# Altium schematic sheet Sheet1.SchDoc
size A4
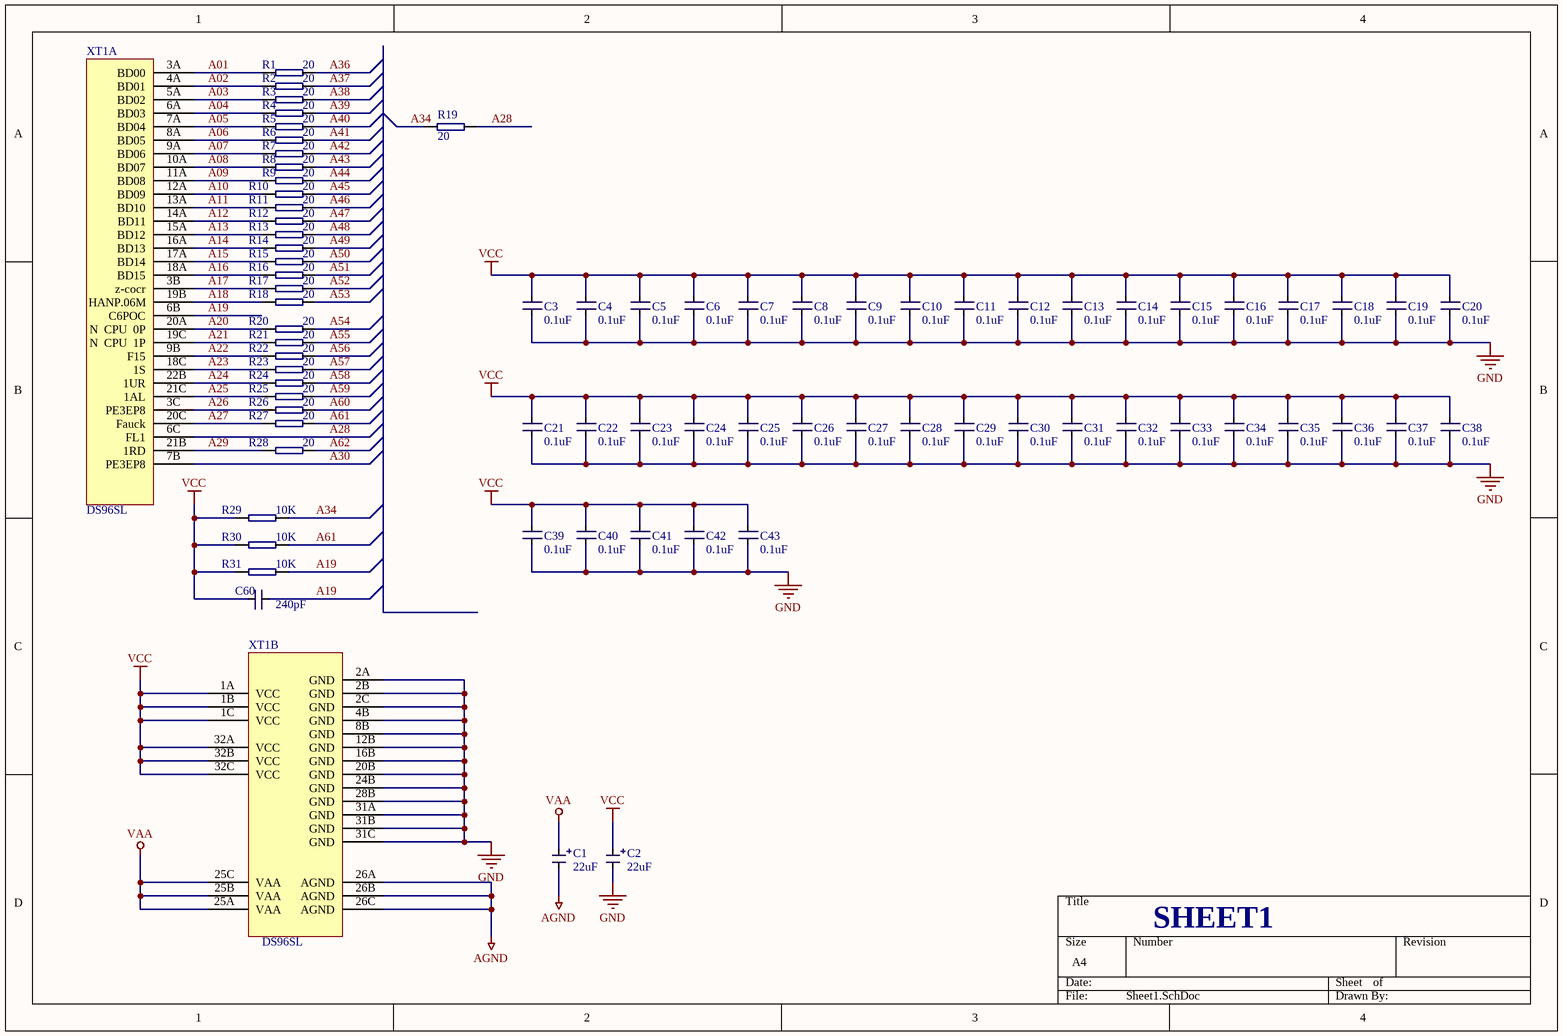
[diagram p0: Sheet1.SchDoc]

## Parts
C1  value 22uF  [B(1812)]  (hidden comment: Cap2)
C2  value 22uF  [B(1812)]  (hidden comment: Cap2)
C3  value 0.1uF  [0805]  (hidden comment: Cap)
C4  value 0.1uF  [0805]  (hidden comment: Cap)
C5  value 0.1uF  [0805]  (hidden comment: Cap)
C6  value 0.1uF  [0805]  (hidden comment: Cap)
C7  value 0.1uF  [0805]  (hidden comment: Cap)
C8  value 0.1uF  [0805]  (hidden comment: Cap)
C9  value 0.1uF  [0805]  (hidden comment: Cap)
C10  value 0.1uF  [0805]  (hidden comment: Cap)
C11  value 0.1uF  [0805]  (hidden comment: Cap)
C12  value 0.1uF  [0805]  (hidden comment: Cap)
C13  value 0.1uF  [0805]  (hidden comment: Cap)
C14  value 0.1uF  [0805]  (hidden comment: Cap)
C15  value 0.1uF  [0805]  (hidden comment: Cap)
C16  value 0.1uF  [0805]  (hidden comment: Cap)
C17  value 0.1uF  [0805]  (hidden comment: Cap)
C18  value 0.1uF  [0805]  (hidden comment: Cap)
C19  value 0.1uF  [0805]  (hidden comment: Cap)
C20  value 0.1uF  [0805]  (hidden comment: Cap)
C21  value 0.1uF  [0805]  (hidden comment: Cap)
C22  value 0.1uF  [0805]  (hidden comment: Cap)
C23  value 0.1uF  [0805]  (hidden comment: Cap)
C24  value 0.1uF  [0805]  (hidden comment: Cap)
C25  value 0.1uF  [0805]  (hidden comment: Cap)
C26  value 0.1uF  [0805]  (hidden comment: Cap)
C27  value 0.1uF  [0805]  (hidden comment: Cap)
C28  value 0.1uF  [0805]  (hidden comment: Cap)
C29  value 0.1uF  [0805]  (hidden comment: Cap)
C30  value 0.1uF  [0805]  (hidden comment: Cap)
C31  value 0.1uF  [0805]  (hidden comment: Cap)
C32  value 0.1uF  [0805]  (hidden comment: Cap)
C33  value 0.1uF  [0805]  (hidden comment: Cap)
C34  value 0.1uF  [0805]  (hidden comment: Cap)
C35  value 0.1uF  [0805]  (hidden comment: Cap)
C36  value 0.1uF  [0805]  (hidden comment: Cap)
C37  value 0.1uF  [0805]  (hidden comment: Cap)
C38  value 0.1uF  [0805]  (hidden comment: Cap)
C39  value 0.1uF  [0805]  (hidden comment: Cap)
C40  value 0.1uF  [0805]  (hidden comment: Cap)
C41  value 0.1uF  [0805]  (hidden comment: Cap)
C42  value 0.1uF  [0805]  (hidden comment: Cap)
C43  value 0.1uF  [0805]  (hidden comment: Cap)
C60  value 240pF  [0805]  (hidden comment: Cap)
R1  value 20  [0805]  (hidden comment: R)
R2  value 20  [0805]  (hidden comment: R)
R3  value 20  [0805]  (hidden comment: R)
R4  value 20  [0805]  (hidden comment: R)
R5  value 20  [0805]  (hidden comment: R)
R6  value 20  [0805]  (hidden comment: R)
R7  value 20  [0805]  (hidden comment: R)
R8  value 20  [0805]  (hidden comment: R)
R9  value 20  [0805]  (hidden comment: R)
R10  value 20  [0805]  (hidden comment: R)
R11  value 20  [0805]  (hidden comment: R)
R12  value 20  [0805]  (hidden comment: R)
R13  value 20  [0805]  (hidden comment: R)
R14  value 20  [0805]  (hidden comment: R)
R15  value 20  [0805]  (hidden comment: R)
R16  value 20  [0805]  (hidden comment: R)
R17  value 20  [0805]  (hidden comment: R)
R18  value 20  [0805]  (hidden comment: R)
R19  value 20  [0805]  (hidden comment: R)
R20  value 20  [0805]  (hidden comment: R)
R21  value 20  [0805]  (hidden comment: R)
R22  value 20  [0805]  (hidden comment: R)
R23  value 20  [0805]  (hidden comment: R)
R24  value 20  [0805]  (hidden comment: R)
R25  value 20  [0805]  (hidden comment: R)
R26  value 20  [0805]  (hidden comment: R)
R27  value 20  [0805]  (hidden comment: R)
R28  value 20  [0805]  (hidden comment: R)
R29  value 10K  [0805]  (hidden comment: R)
R30  value 10K  [0805]  (hidden comment: R)
R31  value 10K  [0805]  (hidden comment: R)
XT1  DS96SL  [DS96]  (parts A,B of 3)

## Nets
AGND: C1.2 XT1.26A(AGND) XT1.26B(AGND) XT1.26C(AGND)
GND: C2.2 C3.1 C4.1 C5.1 C6.1 C7.1 C8.1 C9.1 C10.1 C11.1 C12.1 C13.1 C14.1 C15.1 C16.1 C17.1 C18.1 C19.1 C20.1 C21.1 C22.1 C23.1 C24.1 C25.1 C26.1 C27.1 C28.1 C29.1 C30.1 C31.1 C32.1 C33.1 C34.1 C35.1 C36.1 C37.1 C38.1 C39.1 C40.1 C41.1 C42.1 C43.1 XT1.2A(GND) XT1.2B(GND) XT1.2C(GND) XT1.4B(GND) XT1.8B(GND) XT1.12B(GND) XT1.16B(GND) XT1.20B(GND) XT1.24B(GND) XT1.28B(GND) XT1.31A(GND) XT1.31B(GND) XT1.31C(GND)
VAA: C1.1 XT1.25A(VAA) XT1.25B(VAA) XT1.25C(VAA)
VCC: C2.1 C3.2 C4.2 C5.2 C6.2 C7.2 C8.2 C9.2 C10.2 C11.2 C12.2 C13.2 C14.2 C15.2 C16.2 C17.2 C18.2 C19.2 C20.2 C21.2 C22.2 C23.2 C24.2 C25.2 C26.2 C27.2 C28.2 C29.2 C30.2 C31.2 C32.2 C33.2 C34.2 C35.2 C36.2 C37.2 C38.2 C39.2 C40.2 C41.2 C42.2 C43.2 C60.1 R29.1 R30.1 R31.1 XT1.1A(VCC) XT1.1B(VCC) XT1.1C(VCC) XT1.32A(VCC) XT1.32B(VCC) XT1.32C(VCC)
A01: R1.1 XT1.3A(BD00)
A02: R2.1 XT1.4A(BD01)
A03: R3.1 XT1.5A(BD02)
A04: R4.1 XT1.6A(BD03)
A05: R5.1 XT1.7A(BD04)
A06: R6.1 XT1.8A(BD05)
A07: R7.1 XT1.9A(BD06)
A08: R8.1 XT1.10A(BD07)
A09: R9.1 XT1.11A(BD08)
A10: R10.1 XT1.12A(BD09)
A11: R11.1 XT1.13A(BD10)
A12: R12.1 XT1.14A(BD11)
A13: R13.1 XT1.15A(BD12)
A14: R14.1 XT1.16A(BD13)
A15: R15.1 XT1.17A(BD14)
A16: R16.1 XT1.18A(BD15)
A17: R17.1 XT1.3B(z-cocr)
A18: R18.1 XT1.19B(HANP.06M)
A19: C60.2 R31.2 XT1.6B(C6POC)
A20: R20.1 XT1.20A(N__CPU__0P)
A21: R21.1 XT1.19C(N__CPU__1P)
A22: R22.1 XT1.9B(F15)
A23: R23.1 XT1.18C(1S)
A24: R24.1 XT1.22B(1UR)
A25: R25.1 XT1.21C(1AL)
A26: R26.1 XT1.3C(PE3EP8)
A27: R27.1 XT1.20C(Fauck)
A28: R19.1 XT1.6C(FL1)
A29: R28.1 XT1.21B(1RD)
A30: XT1.7B(PE3EP8)
A34: R19.2 R29.2
A36: R1.2
A37: R2.2
A38: R3.2
A39: R4.2
A40: R5.2
A41: R6.2
A42: R7.2
A43: R8.2
A44: R9.2
A45: R10.2
A46: R11.2
A47: R12.2
A48: R13.2
A49: R14.2
A50: R15.2
A51: R16.2
A52: R17.2
A53: R18.2
A54: R20.2
A55: R21.2
A56: R22.2
A57: R23.2
A58: R24.2
A59: R25.2
A60: R26.2
A61: R27.2 R30.2
A62: R28.2

## Notes on the sheet
- SHEET1